# EAGLE schematic hiveScale (EAGLE 9.6.2)
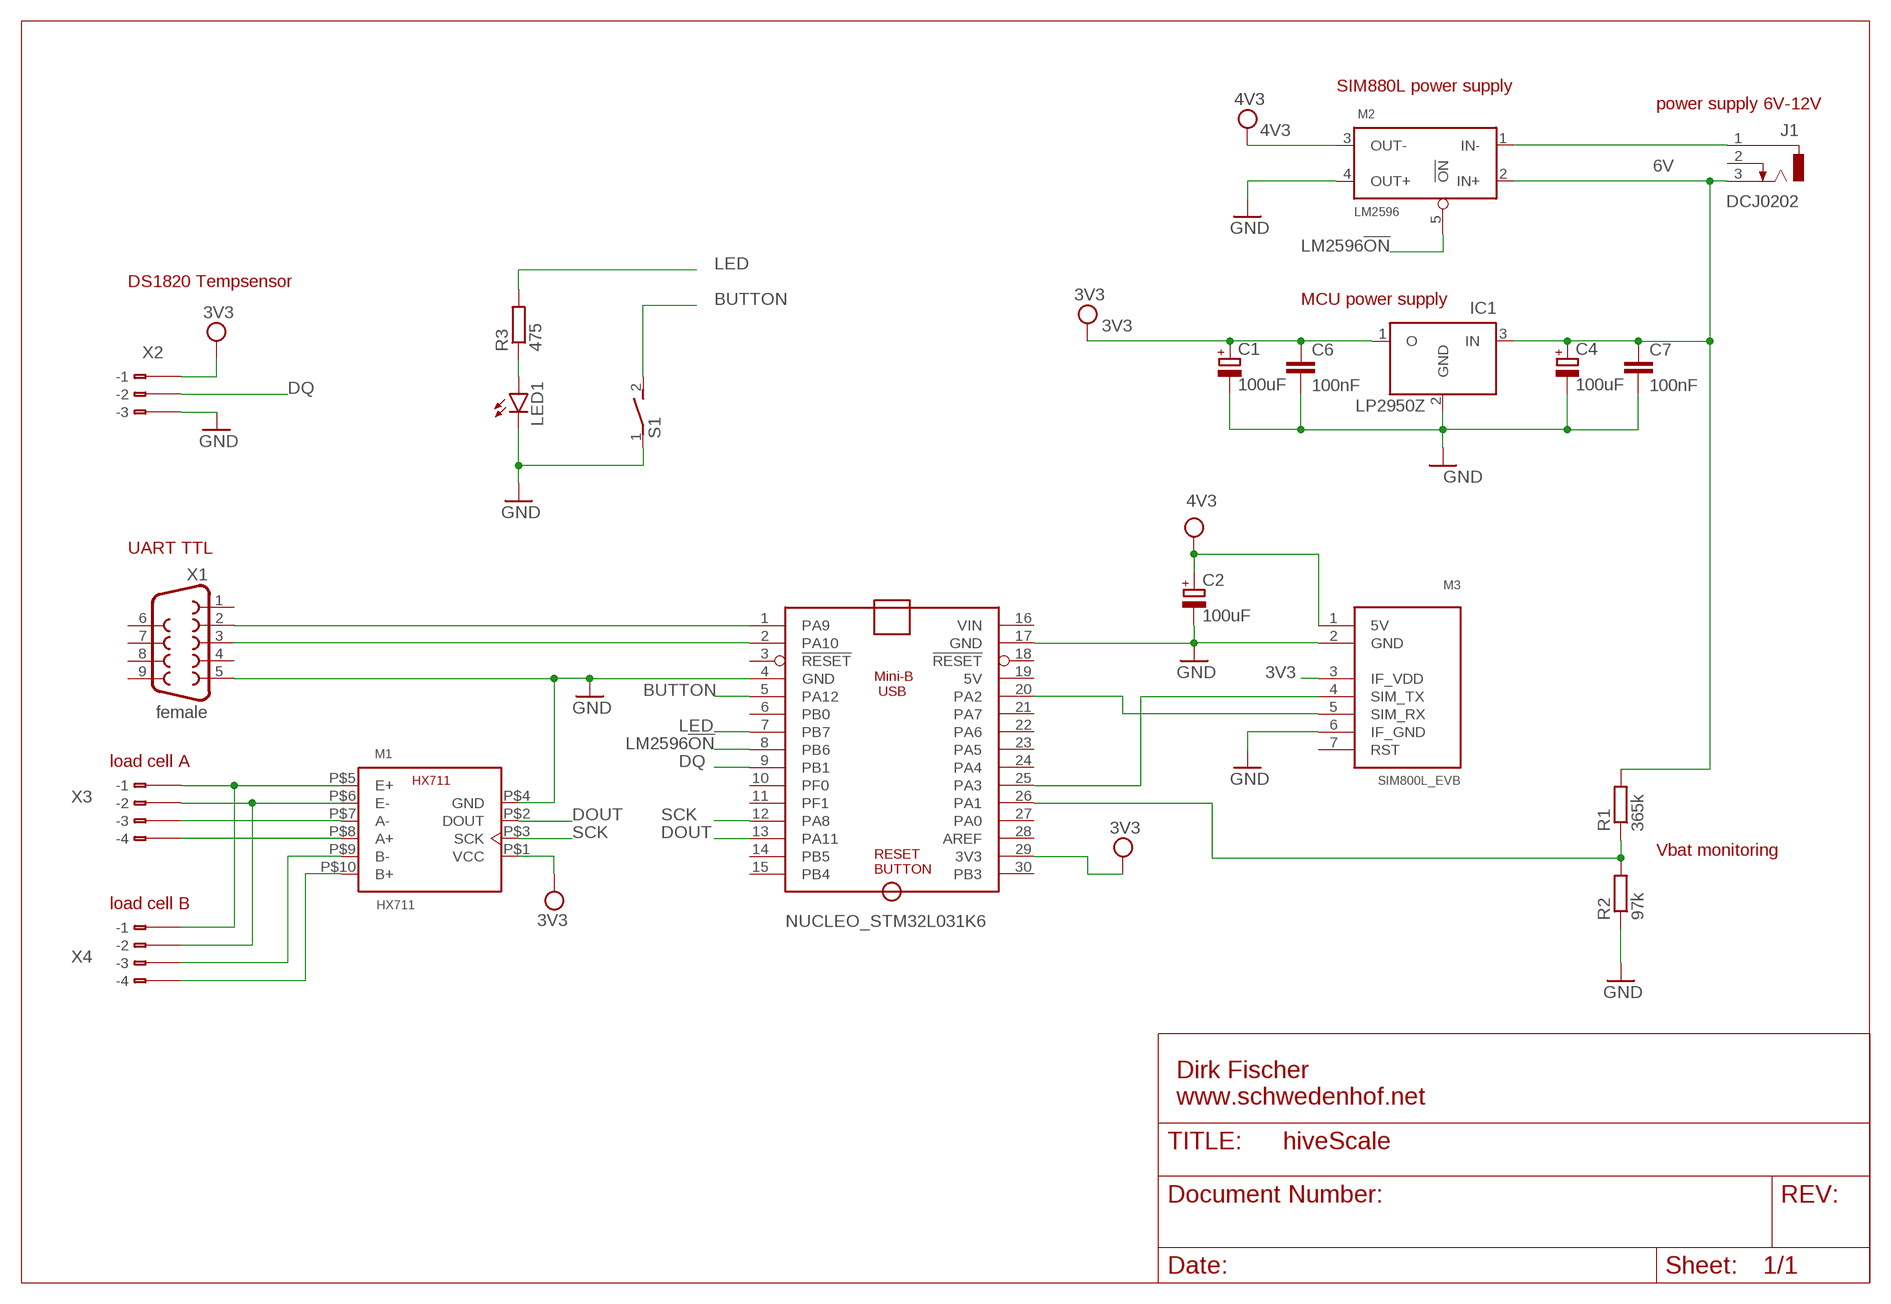
[diagram p0: schematic, sheet 1]

## Parts
C1  100uF  CPOL-EU085CS-1AR  [085CS_1AR]
C2  100uF  CPOL-EU085CS-1AR  [085CS_1AR]
C4  100uF  CPOL-EU085CS-1AR  [085CS_1AR]
C6  100nF  C-EU025-024X044  [C025-024X044]
C7  100nF  C-EU025-024X044  [C025-024X044]
IC1  LP2950Z  [TO92]
J1  DCJ0202  [DCJ0202]
LED1  LED5MM  [LED5MM]
M1  HX711  [HX711]
M2  LM2596  [LM2596]
M3  SIM800L_EVB  [SIM800L_EVB]
NUCLEO_STM32L031K6  ARDUINO_NANO  [ARDUINO_NANO]
R1  365k  R-EU_0204/7  [0204/7]
R2  97k  R-EU_0204/7  [0204/7]
R3  475  R-EU_0204/7  [0204/7]
S1  DS01E  [DS-01]
X1  female  F09VP  [F09VP]
X2  233-103  [233-103]
X3  233-104  [233-104]
X4  233-104  [233-104]

## Nets
3V3: C1.+ C6.1 IC1.1(O) M1.P$1(VCC) M3.3(IF_VDD) NUCLEO_STM32L031K6.29(3V3) X2.B1(B-1)
4V3: C2.+ M2.3(OUT-) M3.1(5V)
6V: C4.+ C7.1 IC1.3(IN) J1.3 M2.2(IN+) R1.2
BUTTON: NUCLEO_STM32L031K6.5(PA12) S1.2
DOUT: M1.P$2(DOUT) NUCLEO_STM32L031K6.13(PA11)
DQ: NUCLEO_STM32L031K6.9(PB1) X2.B2(B-2)
GND: C1.- C2.- C4.- C6.2 C7.2 IC1.2(GND) LED1.K(C) M1.P$4(GND) M2.4(OUT+) M3.2(GND) M3.6(IF_GND) NUCLEO_STM32L031K6.4(GND) NUCLEO_STM32L031K6.17(GND) R2.1 S1.1 X1.5 X2.B3(B-3)
LED: NUCLEO_STM32L031K6.7(PB7) R3.2
LM2596!ON: M2.5(!ON) NUCLEO_STM32L031K6.8(PB6)
N$1: M3.5(SIM_RX) NUCLEO_STM32L031K6.20(PA2)
N$2: M3.4(SIM_TX) NUCLEO_STM32L031K6.25(PA3)
N$4: J1.1 M2.1(IN-)
N$7: M1.P$5(E+) X3.B1(B-1) X4.B1(B-1)
N$8: NUCLEO_STM32L031K6.1(PA9) X1.2
N$9: NUCLEO_STM32L031K6.26(PA1) R1.1 R2.2
N$10: M1.P$6(E-) X3.B2(B-2) X4.B2(B-2)
N$11: M1.P$7(A-) X3.B3(B-3)
N$12: M1.P$8(A+) X3.B4(B-4)
N$13: M1.P$9(B-) X4.B3(B-3)
N$14: M1.P$10(B+) X4.B4(B-4)
N$15: NUCLEO_STM32L031K6.2(PA10) X1.3
N$16: LED1.A R3.1
SCK: M1.P$3(SCK) NUCLEO_STM32L031K6.12(PA8)
Unconnected: J1.2 M3.7(RST) NUCLEO_STM32L031K6.3(!RESET) NUCLEO_STM32L031K6.6(PB0) NUCLEO_STM32L031K6.10(PF0) NUCLEO_STM32L031K6.11(PF1) NUCLEO_STM32L031K6.14(PB5) NUCLEO_STM32L031K6.15(PB4) NUCLEO_STM32L031K6.18(!RESET) NUCLEO_STM32L031K6.21(PA7) NUCLEO_STM32L031K6.22(PA6) NUCLEO_STM32L031K6.23(PA5) NUCLEO_STM32L031K6.24(PA4) NUCLEO_STM32L031K6.27(PA0) NUCLEO_STM32L031K6.28(AREF) NUCLEO_STM32L031K6.30(PB3) X1.1 X1.4 X1.6 X1.7 X1.8 X1.9 X2.A1(-1) X2.A2(-2) X2.A3(-3) X3.A1(-1) X3.A2(-2) X3.A3(-3) X3.A4(-4) X4.A1(-1) X4.A2(-2) X4.A3(-3) X4.A4(-4)

## Notes on the sheet
- SIM880L power supply
- power supply 6V-12V
- DS1820 Tempsensor
- MCU power supply
- UART TTL
- load cell A
- Vbat monitoring
- load cell B
- Dirk Fischer
  www.schwedenhof.net

## Power pins joined to a net without a drawn wire
5V: NUCLEO_STM32L031K6.19(5V)
VIN: NUCLEO_STM32L031K6.16(VIN)

## Library data of the parts
C1 C2 C4 = rcl:CPOL-EU: POLARIZED CAPACITOR, European symbol; SPICEPREFIX: C
C6 C7 = rcl:C-EU: CAPACITOR, European symbol; SPICEPREFIX: C
IC1 = national-semiconductor:LP2950: Adjustable Micropower Voltage Regulator PIN-Connection corrected by http://www.ti.com/lit/ds/symlink/lp2950-n.pdf; MF: NATIONAL SEMICONDUCTOR; MPN: LP2950CZ-5.0/NOPB; OC_FARNELL: 1150320; OC_NEWARK: 41K6545
J1 = con-jack:DCJ0202: DC POWER JACK Source: DCJ0202.pdf; OC_FARNELL: unknown; OC_NEWARK: unknown
LED1 = led:LED: LED OSRAM: - CHIPLED LG R971, LG N971, LY N971, LG Q971, LY Q971, LO R971, LY R971 LH N974, LH R974 LS Q976, LO Q976, LY Q976 LO Q996 - Hyper CHIPLED LW Q18S LB Q993, LB Q99A, LB R99A - SideLED LS A670, LO A670, LY A670, LG A670, LP A670 LB A673, LV A673, LT A673, LW A673 LH A674 LY A675 LS A676, LA A676, LO A676, LY A676, LW A676 LS A679, LY A679, LG A679 - Hyper Micro SIDELED® LS Y876, LA Y876, LO Y876, LY Y876 LT Y87S - SmartLED LW L88C, LW L88S LB L89C, LB L89S, LG L890 LS L89K, LO L89K, LY L89K LS L896, LA L896, LO L896, LY L896 - TOPLED LS T670, LO T670, LY T670, LG T670, LP T670 LSG T670, LSP T670, LSY T670, LOP T670, LYG T670 LG T671, LOG T671, LSG T671 LB T673, LV T673, LT T673, LW T673 LH T674 LS T676, LA T676, LO T676, LY T676, LB T676, LH T676, LSB T676, LW T676 LB T67C, LV T67C, LT T67C, LS T67K, LO T67K, LY T67K, LW E67C LS E67B, LA E67B, LO E67B, LY E67B, LB E67C, LV E67C, LT E67C LW T67C LS T679, LY T679, LG T679 LS T770, LO T770, LY T770, LG T770, LP T770 LB T773, LV T773, LT T773, LW T773 LH T774 LS E675, LA E675, LY E675, LS T675 LS T776, LA T776, LO T776, LY T776, LB T776 LHGB T686 LT T68C, LB T68C - Hyper Mini TOPLED® LB M676 - Mini TOPLED Santana® LG M470 LS M47K, LO M47K, LY M47K Source: http://www.osram.convergy.de LUXEON: - LUMILED® LXK2-PW12-R00, LXK2-PW12-S00, LXK2-PW14-U00, LXK2-PW14-V00 LXK2-PM12-R00, LXK2-PM12-S00, LXK2-PM14-U00 LXK2-PE12-Q00, LXK2-PE12-R00, LXK2-PE12-S00, LXK2-PE14-T00, LXK2-PE14-U00 LXK2-PB12-K00, LXK2-PB12-L00, LXK2-PB12-M00, LXK2-PB14-N00, LXK2-PB14-P00, LXK2-PB14-Q00 LXK2-PR12-L00, LXK2-PR12-M00, LXK2-PR14-Q00, LXK2-PR14-R00 LXK2-PD12-Q00, LXK2-PD12-R00, LXK2-PD12-S00 LXK2-PH12-R00, LXK2-PH12-S00 LXK2-PL12-P00, LXK2-PL12-Q00, LXK2-PL12-R00 Source: www.luxeon.com KINGBRIGHT: KA-3528ASYC Source: www.kingbright.com
M1 = hiveScale:HX711
M2 = hiveScale:LM2596
M3 = hiveScale:SIM800L_EVB
NUCLEO_STM32L031K6 = ArduinoNanoV30:ARDUINO_NANO: Arduino Nano V3.0 Overview: The Arduino Nano is a small, complete, and breadboard-friendly board based on the ATmega328 (Arduino Nano 3.x) or ATmega168 (Arduino Nano 2.x). It has more or less the same functionality of the Arduino Duemilanove, but in a different package. It lacks only a DC power jack, and works with a Mini-B USB cable instead of a standard one. The Nano was designed and is being produced by Gravitech. Specifications: Microcontroller Atmel ATmega168 or ATmega328 Operating Voltage (logic level) 5 V Input Voltage (recommended) 7-12 V Input Voltage (limits) 6-20 V Digital I/O Pins 14 (of which 6 provide PWM output) Analog Input Pins 8 DC Current per I/O Pin 40 mA Flash Memory 16 KB (ATmega168) or 32 KB (ATmega328) of which 2 KB used by bootloader SRAM 1 KB (ATmega168) or 2 KB (ATmega328) EEPROM 512 bytes (ATmega168) or 1 KB (ATmega328) Clock Speed 16 MHz Dimensions 0.73" x 1.70" Length 45 mm Width 18 mm Weigth 5 g Power: The Arduino Nano can be powered via the Mini-B USB connection, 6-20V unregulated external power supply (pin 30), or 5V regulated external power supply (pin 27). The power source is automatically selected to the highest voltage source. Memory: The ATmega168 has 16 KB of flash memory for storing code (of which 2 KB is used for the bootloader); the ATmega328 has 32 KB, (also with 2 KB used for the bootloader). The ATmega168 has 1 KB of SRAM and 512 bytes of EEPROM (which can be read and written with the EEPROM library); the ATmega328 has 2 KB of SRAM and 1 KB of EEPROM. Input and Output: Each of the 14 digital pins on the Nano can be used as an input or output, using pinMode(), digitalWrite(), and digitalRead() functions. They operate at 5 volts. Each pin can provide or receive a maximum of 40 mA and has an internal pull-up resistor (disconnected by default) of 20-50 kOhms. In addition, some pins have specialized functions. Visit Arduino - ArduinoBoardNano <https://www.arduino.cc/en/Main/ArduinoBoardNano>
R1-R3 = rcl:R-EU_: RESISTOR, European symbol; SPICEPREFIX: R
S1 = switch-dil:DS01E: DIL/CODE SWITCH; OC_FARNELL: unknown; OC_NEWARK: unknown
X1 = con-subd:F09: SUB-D; OC_FARNELL: unknown; OC_NEWARK: unknown
X2 = con-wago:233-103: WAGO Cage Clamp; MPN: 233-103; OC_FARNELL: unknown; OC_NEWARK: 28K9045
X3 X4 = con-wago:233-104: WAGO Cage Clamp; MPN: 233-104; OC_FARNELL: unknown; OC_NEWARK: 28K9046